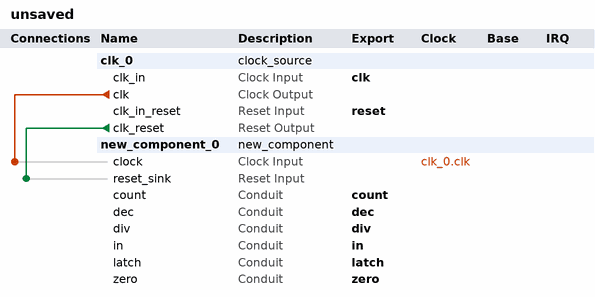
[diagram p0: system contents]
# Platform Designer (Qsys) system unsaved, Cyclone V 5CGXFC7C7F23C8
# Parameters at their usual value, and those the tool derives, are not listed.
package require -exact qsys 22.1
create_system unsaved
set_project_property DEVICE_FAMILY {Cyclone V}
set_project_property DEVICE 5CGXFC7C7F23C8

add_instance clk_0 clock_source 22.1
set_instance_parameter_value clk_0 clockFrequency 50000000

add_instance new_component_0 new_component 1.0

# connections
add_connection clk_0.clk new_component_0.clock clock
add_connection clk_0.clk_reset new_component_0.reset_sink reset

# exported interfaces
add_interface clk clock sink
set_interface_property clk EXPORT_OF clk_0.clk_in
add_interface count conduit end
set_interface_property count EXPORT_OF new_component_0.count
add_interface dec conduit end
set_interface_property dec EXPORT_OF new_component_0.dec
add_interface div conduit end
set_interface_property div EXPORT_OF new_component_0.div
add_interface in conduit end
set_interface_property in EXPORT_OF new_component_0.in
add_interface latch conduit end
set_interface_property latch EXPORT_OF new_component_0.latch
add_interface reset reset sink
set_interface_property reset EXPORT_OF clk_0.clk_in_reset
add_interface zero conduit end
set_interface_property zero EXPORT_OF new_component_0.zero

set_interconnect_requirement {$system} qsys_mm.clockCrossingAdapter HANDSHAKE
set_interconnect_requirement {$system} qsys_mm.enableEccProtection FALSE
set_interconnect_requirement {$system} qsys_mm.insertDefaultSlave FALSE
set_interconnect_requirement {$system} qsys_mm.maxAdditionalLatency 1

save_system unsaved.qsys
